# EAGLE design untitled (EAGLE 9.6.2)
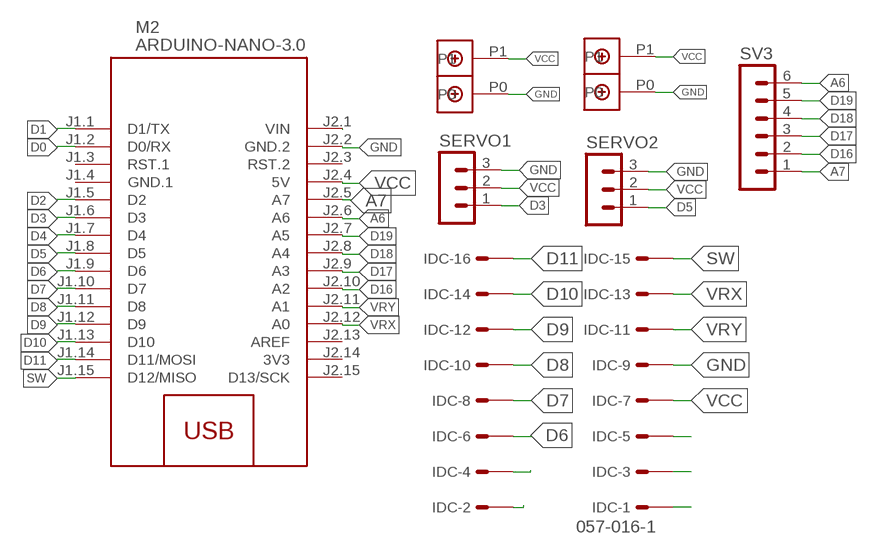
[diagram p0: schematic, sheet 1]

## Parts
IDC  057-016-1  [057-016-1]
M2  ARDUINO-NANO-3.0  [ARDUINO-NANO-3.0]
SERVO1  MA03-1  [MA03-1]
SERVO2  MA03-1  [MA03-1]
SV3  MA06-1  [MA06-1]
U$1  DBCONN-1X2  [DBCONN-1X2]
U$2  DBCONN-1X2  [DBCONN-1X2]

## Nets
A6: M2.J2.6(A6) SV3.6
A7: M2.J2.5(A7) SV3.1
D: IDC.2 IDC.4
D0: M2.J1.2(D0/RX)
D1: M2.J1.1(D1/TX)
D2: M2.J1.5(D2)
D3: M2.J1.6(D3) SERVO1.1
D4: M2.J1.7(D4)
D5: M2.J1.8(D5) SERVO2.1
D6: IDC.6 M2.J1.9(D6)
D7: IDC.8 M2.J1.10(D7)
D8: IDC.10 M2.J1.11(D8)
D9: IDC.12 M2.J1.12(D9)
D10: IDC.14 M2.J1.13(D10)
D11: IDC.16 M2.J1.14(D11/MOSI)
D16: M2.J2.10(A2) SV3.2
D17: M2.J2.9(A3) SV3.3
D18: M2.J2.8(A4) SV3.4
D19: M2.J2.7(A5) SV3.5
GND: IDC.9 M2.J2.2(GND.2) SERVO1.3 SERVO2.3 U$1.P0 U$2.P0
N$14: IDC.5
N$15: IDC.3
N$16: IDC.1
SW: IDC.15 M2.J1.15(D12/MISO)
VCC: IDC.7 M2.J2.1(VIN) M2.J2.4(5V) SERVO1.2 SERVO2.2 U$1.P1 U$2.P1
VRX: IDC.13 M2.J2.12(A0)
VRY: IDC.11 M2.J2.11(A1)
Unconnected: M2.J1.3(RST.1) M2.J2.3(RST.2) M2.J2.13(AREF) M2.J2.15(D13/SCK)

## Power pins joined to a net without a drawn wire
3V3: M2.J2.14(3V3)
GND.1: M2.J1.4(GND.1)

## Library data of the parts
IDC = con-panduit:057-016-: CONNECTOR 10-pin series 057 contact pc board low profile headers; OC_FARNELL: unknown; OC_NEWARK: unknown
M2 = diy-modules:ARDUINO-NANO-3.0: Arduino Nano 3.0 and compatible devices More details available here: https://www.arduino.cc/en/Main/ArduinoBoardNano Click here to find device on ebay.com <http://www.ebay.com/sch/arduino+nano>
SERVO1 SERVO2 = con-lstb:MA03-1: PIN HEADER; OC_FARNELL: unknown; OC_NEWARK: unknown
SV3 = con-lstb:MA06-1: PIN HEADER; OC_FARNELL: unknown; OC_NEWARK: unknown
U$1 U$2 = Terminal Block Connector:DBCONN-1X2

## Board
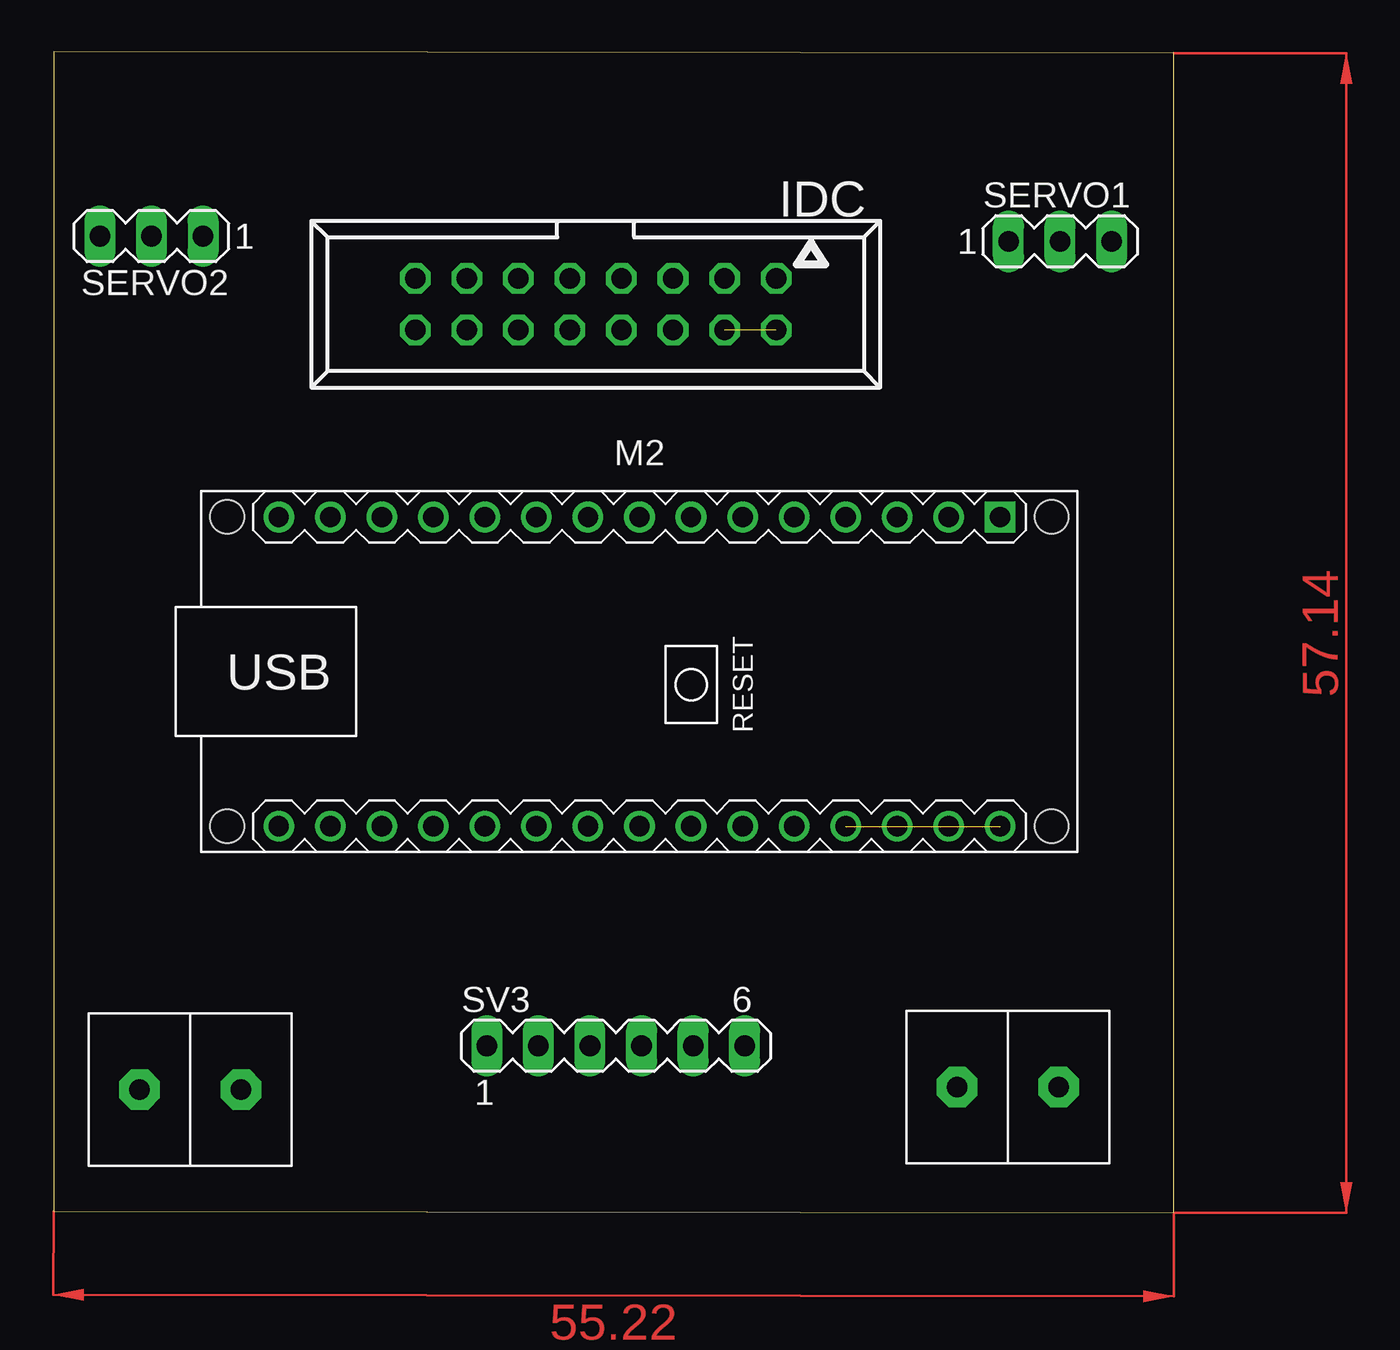
[diagram p1: board, top side]
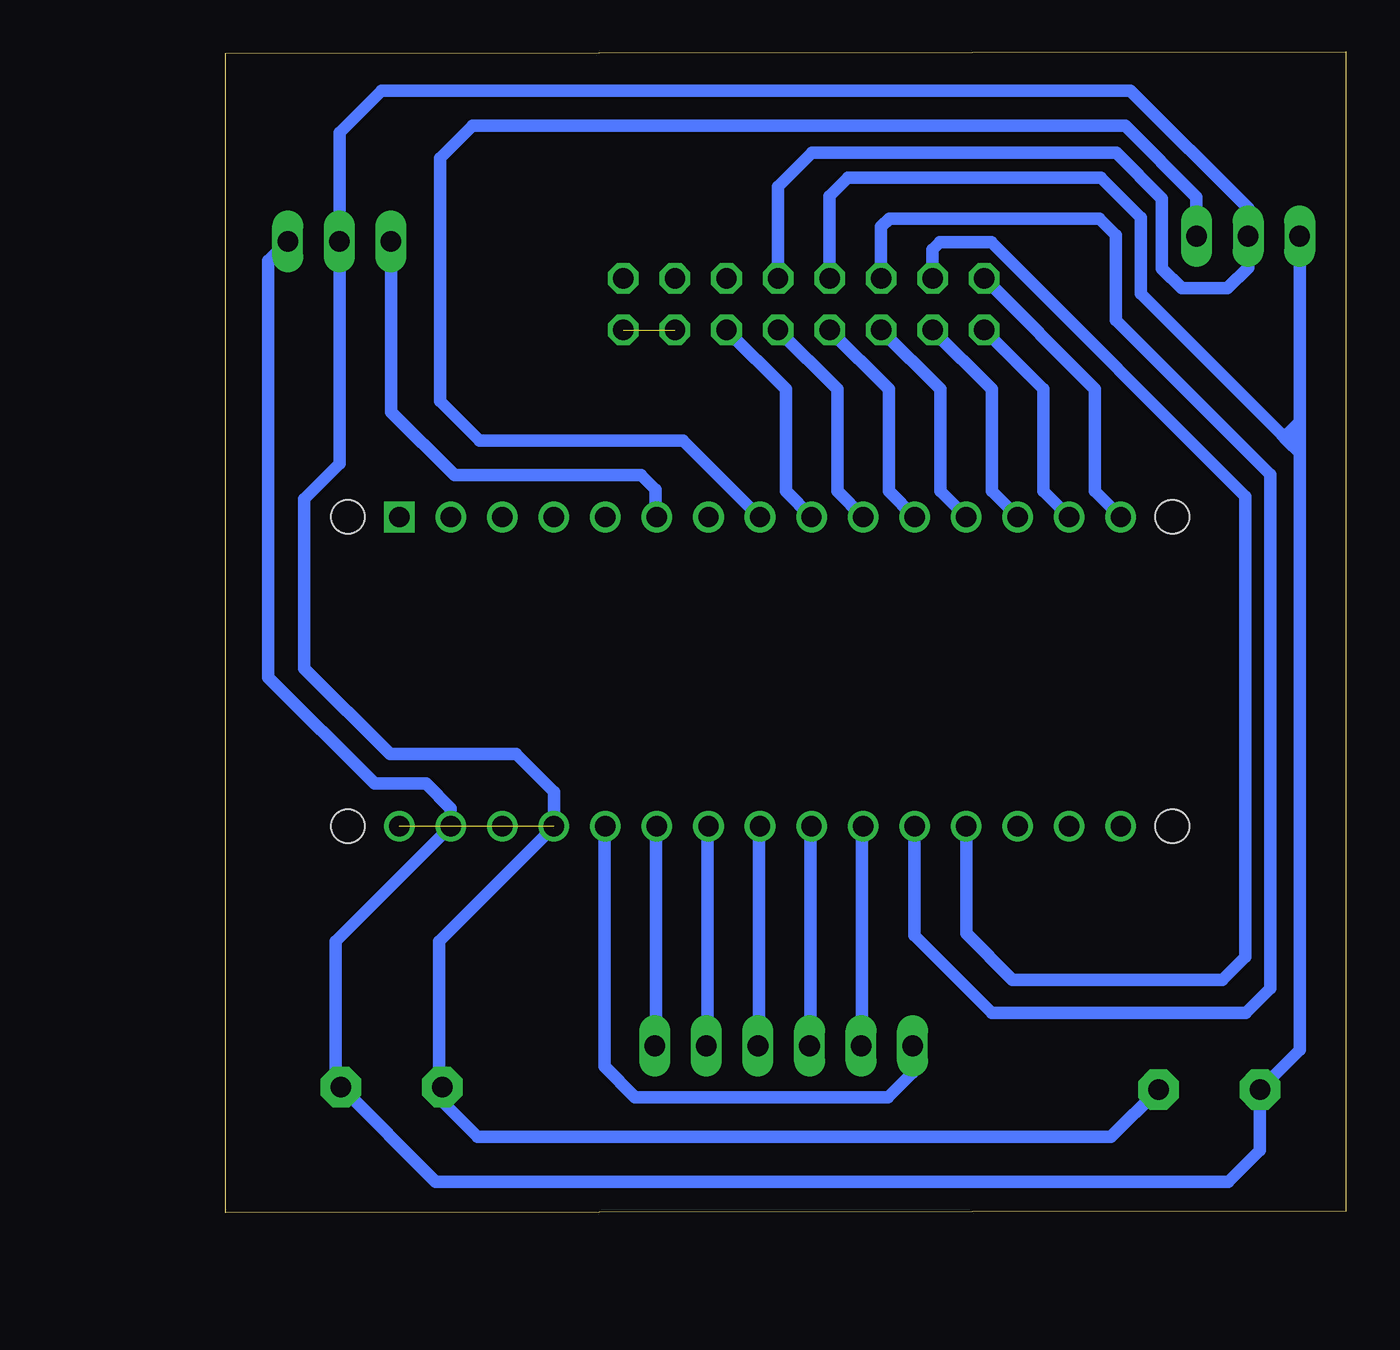
[diagram p2: board, bottom side, seen from below]

Size 55.22 x 57.22 mm. Coordinates in mm from the lower left corner, seen from the top.
Outline: 0,0.08 55.22,0 55.22,57.14 0,57.22 0,0.08
Copper layers (1*16): Top 0.035mm / dielectric 1.5mm / Bottom 0.035mm
Design rules "default": minimum track width 6mil, minimum drill 0.35mm, track to track 6mil, track to pad 6mil, pad to pad 6mil, via to via 6mil, smd to smd 6mil, copper to edge 40mil, drill to drill 6mil, minimum pad ring 10mil, minimum via ring 8mil, stop-mask expansion 4mil, vias tented up to drill 0mil, thermal gap 10mil

### Footprints (pad centres in the part's own frame; a part is rotated, then mirrored left to right if it is on the bottom)
057-016-1 = drill 1 octagon: 1 -8.89,-1.27; 2 -8.89,1.27; 3 -6.35,-1.27; 4 -6.35,1.27; 5 -3.81,-1.27; 6 -3.81,1.27; 7 -1.27,-1.27; 8 -1.27,1.27; 9 1.27,-1.27; 10 1.27,1.27; 11 3.81,-1.27; 12 3.81,1.27; 13 6.35,-1.27; 14 6.35,1.27; 15 8.89,-1.27; 16 8.89,1.27
ARDUINO-NANO-3.0 = drill 1 square: J1.1 17.78,7.62 | drill 1: J1.2 15.24,7.62; J1.3 12.7,7.62; J1.4 10.16,7.62; J1.5 7.62,7.62; J1.6 5.08,7.62; J1.7 2.54,7.62; J1.8 0,7.62; J1.9 -2.54,7.62; J1.10 -5.08,7.62; J1.11 -7.62,7.62; J1.12 -10.16,7.62; J1.13 -12.7,7.62; J1.14 -15.24,7.62; J1.15 -17.78,7.62; J2.1 17.78,-7.62; J2.2 15.24,-7.62; J2.3 12.7,-7.62; J2.4 10.16,-7.62; J2.5 7.62,-7.62; J2.6 5.08,-7.62; J2.7 2.54,-7.62; J2.8 0,-7.62; J2.9 -2.54,-7.62; J2.10 -5.08,-7.62; J2.11 -7.62,-7.62; J2.12 -10.16,-7.62; J2.13 -12.7,-7.62; J2.14 -15.24,-7.62; J2.15 -17.78,-7.62 | hole 1.651: -20.32,7.62; -20.32,-7.62; 20.32,-7.62; 20.32,7.62
MA03-1 = drill 1.016 long: 1 -2.54,0; 2 0,0; 3 2.54,0
MA06-1 = drill 1.016 long: 1 -6.35,0; 2 -3.81,0; 3 -1.27,0; 4 1.27,0; 5 3.81,0; 6 6.35,0
DBCONN-1X2 = drill 1 pad 2 octagon: P0 -2.54,0; P1 2.46,0

### Placement (x,y rotation side)
IDC  26.72,44.78 180 top
M2  28.88,26.67 0 top
SERVO1  49.61,47.88 0 top
SERVO2  4.83,48.13 180 top
SV3  27.71,8.23 0 top
U$1  46.99,6.2 180 top
U$2  6.78,6.07 0 top

### Tracks (layer width: path | path; a pad name or v marks a point on that pad's centre or on a via)
A6
  Bottom 0.61: M2.J2.6 34.01,19 34.01,8.28 SV3.6
A7
  Bottom 0.61: M2.J2.5 36.55,19 36.55,7.21 35.03,5.69 22.58,5.69 21.36,6.91 SV3.1
D  (1 unrouted)
D3
  Bottom 0.61: SERVO1.1 47.07,39.47 43.94,36.35 34.75,36.35 34.04,35.64 34.04,34.37 M2.J1.6
D5
  Bottom 0.61: SERVO2.1 7.37,50.06 10.87,53.57 43.05,53.57 44.65,51.97 44.65,40 42.7,38.05 32.66,38.05 28.9,34.29 M2.J1.8
D6
  Bottom 0.61: IDC.6 27.61,40.59 27.61,35.56 M2.J1.9
D7
  Bottom 0.61: IDC.8 25.07,40.59 25.07,35.56 M2.J1.10
D8
  Bottom 0.61: IDC.10 22.53,40.59 22.53,35.56 M2.J1.11
D9
  Bottom 0.61: IDC.12 19.99,40.59 19.99,35.56 M2.J1.12
D10
  Bottom 0.61: M2.J1.13 17.45,35.56 17.45,40.59 IDC.14
D11
  Bottom 0.61: M2.J1.14 14.91,35.56 14.91,40.59 IDC.16
D16
  Bottom 0.61: M2.J2.10 23.85,19 23.85,8.28 SV3.2
D17
  Bottom 0.61: M2.J2.9 26.39,19 26.39,8.28 SV3.3
D18
  Bottom 0.61: M2.J2.8 28.93,19 28.93,8.28 SV3.4
D19
  Bottom 0.61: M2.J2.7 31.47,19 31.47,8.28 SV3.5
GND
  Bottom 0.61: SERVO1.3 53.11,46.91 53.11,26.39 47.88,21.16 45.34,21.16 44.12,19.94 M2.J2.2 49.78,13.39 49.78,6.17 U$1.P0 44.86,1.52 5.79,1.52 4.24,3.07 U$2.P0 2.29,8.03 2.29,37.46 | 2.29,37.46 2.29,38.18 | 2.29,38.18 2.29,38.99 | 2.29,38.99 SERVO2.3 | IDC.9 25.45,50.1 24.55,51 12.09,51 10.12,49.03 10.12,45.3 3.16,38.34 | 3.16,38.34 2.91,38.09 | 2.91,38.09 2.29,37.46 | 2.29,38.18 2.51,38.18 | 2.51,38.18 2.82,38.18 2.91,38.09 | 2.51,38.18 2.68,38.34 2.92,38.34 | 2.92,38.34 3.16,38.34 | 2.29,38.99 2.92,38.35 2.92,38.34
SW
  Bottom 0.61: IDC.15 12.37,40.59 12.37,35.56 M2.J1.15
VCC  (1 unrouted)
  Bottom 0.61: U$2.P1 11.58,3.73 42.8,3.73 44.53,5.46 U$1.P1 44.7,6.02 44.7,13.39 M2.J2.4 39.04,20.75 40.89,22.61 47.12,22.61 51.35,26.83 51.35,35.18 49.61,36.92 SERVO1.2 49.61,53.24 47.53,55.31 10.62,55.31 4.83,49.52 SERVO2.2 4.83,46.58 5.84,45.57 8.1,45.57 9.07,46.53 9.07,49.99 11.33,52.25 26.31,52.25 27.99,50.57 IDC.7
VRX
  Bottom 0.61: M2.J2.12 18.72,13.77 16.43,11.48 6.1,11.48 4.95,12.62 4.95,35.31 17.47,47.83 20.01,47.83 20.37,47.47 IDC.13
VRY
  Bottom 0.61: M2.J2.11 21.26,13.67 17.45,9.86 4.93,9.86 3.73,11.05 3.73,36.37 11.35,43.99 11.35,48.18 12.17,49 22.5,49 22.91,48.59 IDC.11
(copper drawn outside any net)
  shapes: Top area x2